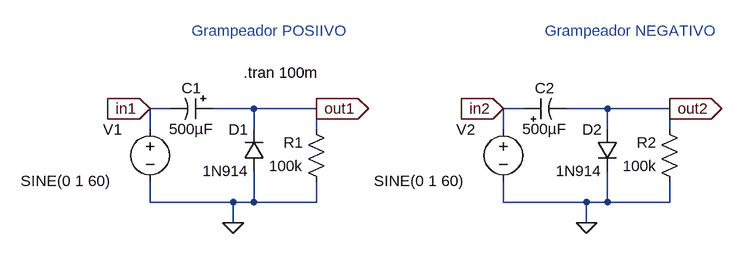
[diagram p0: schematic Circuitos grampeadores com diodos.asc]
Circuitos grampeadores com diodos.asc, the LTspice schematic file:
Version 4.1
SHEET 1 1296 2276
WIRE -32 -16 -64 -16
WIRE 96 -16 32 -16
WIRE 192 -16 96 -16
WIRE 512 -16 480 -16
WIRE 640 -16 576 -16
WIRE 736 -16 640 -16
WIRE -64 16 -64 -16
WIRE 96 16 96 -16
WIRE 192 16 192 -16
WIRE 480 16 480 -16
WIRE 640 16 640 -16
WIRE 736 16 736 -16
WIRE -64 128 -64 96
WIRE 64 128 -64 128
WIRE 96 128 96 80
WIRE 96 128 64 128
WIRE 192 128 192 96
WIRE 192 128 96 128
WIRE 480 128 480 96
WIRE 608 128 480 128
WIRE 640 128 640 80
WIRE 640 128 608 128
WIRE 736 128 736 96
WIRE 736 128 640 128
WIRE 64 160 64 128
WIRE 608 160 608 128
FLAG 64 160 0
FLAG -64 -16 in1
IOPIN -64 -16 In
FLAG 192 -16 out1
IOPIN 192 -16 Out
FLAG 608 160 0
FLAG 480 -16 in2
IOPIN 480 -16 In
FLAG 736 -16 out2
IOPIN 736 -16 Out
SYMBOL diode 112 80 R180
WINDOW 0 24 64 Left 2
WINDOW 3 24 0 Left 2
SYMATTR InstName D1
SYMATTR Value 1N914
SYMBOL res 208 112 R180
WINDOW 0 36 76 Left 2
WINDOW 3 36 40 Left 2
SYMATTR InstName R1
SYMATTR Value 100k
SYMBOL voltage -64 0 R0
WINDOW 0 -72 16 Left 2
WINDOW 3 -199 95 Left 2
WINDOW 123 0 0 Left 0
WINDOW 39 0 0 Left 0
SYMATTR InstName V1
SYMATTR Value SINE(0 1 60)
SYMBOL polcap 32 -32 R90
WINDOW 0 0 32 VBottom 2
WINDOW 3 32 32 VTop 2
SYMATTR InstName C1
SYMATTR Value 500µF
SYMBOL diode 656 16 M0
SYMATTR InstName D2
SYMATTR Value 1N914
SYMBOL res 752 112 R180
WINDOW 0 36 76 Left 2
WINDOW 3 36 40 Left 2
SYMATTR InstName R2
SYMATTR Value 100k
SYMBOL voltage 480 0 R0
WINDOW 0 -72 16 Left 2
WINDOW 3 -199 95 Left 2
WINDOW 123 0 0 Left 0
WINDOW 39 0 0 Left 0
SYMATTR InstName V2
SYMATTR Value SINE(0 1 60)
SYMBOL polcap 512 0 R270
WINDOW 0 32 32 VTop 2
WINDOW 3 0 32 VBottom 2
SYMATTR InstName C2
SYMATTR Value 500µF
TEXT 80 -72 Left 2 !.tran 100m
TEXT 0 -136 Left 2 ;Grampeador POSIIVO
TEXT 544 -136 Left 2 ;Grampeador NEGATIVO

The netlist it stands for:
* Circuitos grampeadores com diodos.asc
D1 0 out1 1N914
R1 0 out1 100k
V1 in1 0 SINE(0 1 60)
C1 out1 in1 500µF
D2 out2 0 1N914
R2 0 out2 100k
V2 in2 0 SINE(0 1 60)
C2 in2 out2 500µF
.model D D
.lib standard.dio
.tran 100m
* Grampeador POSIIVO
* Grampeador NEGATIVO
.backanno
.end